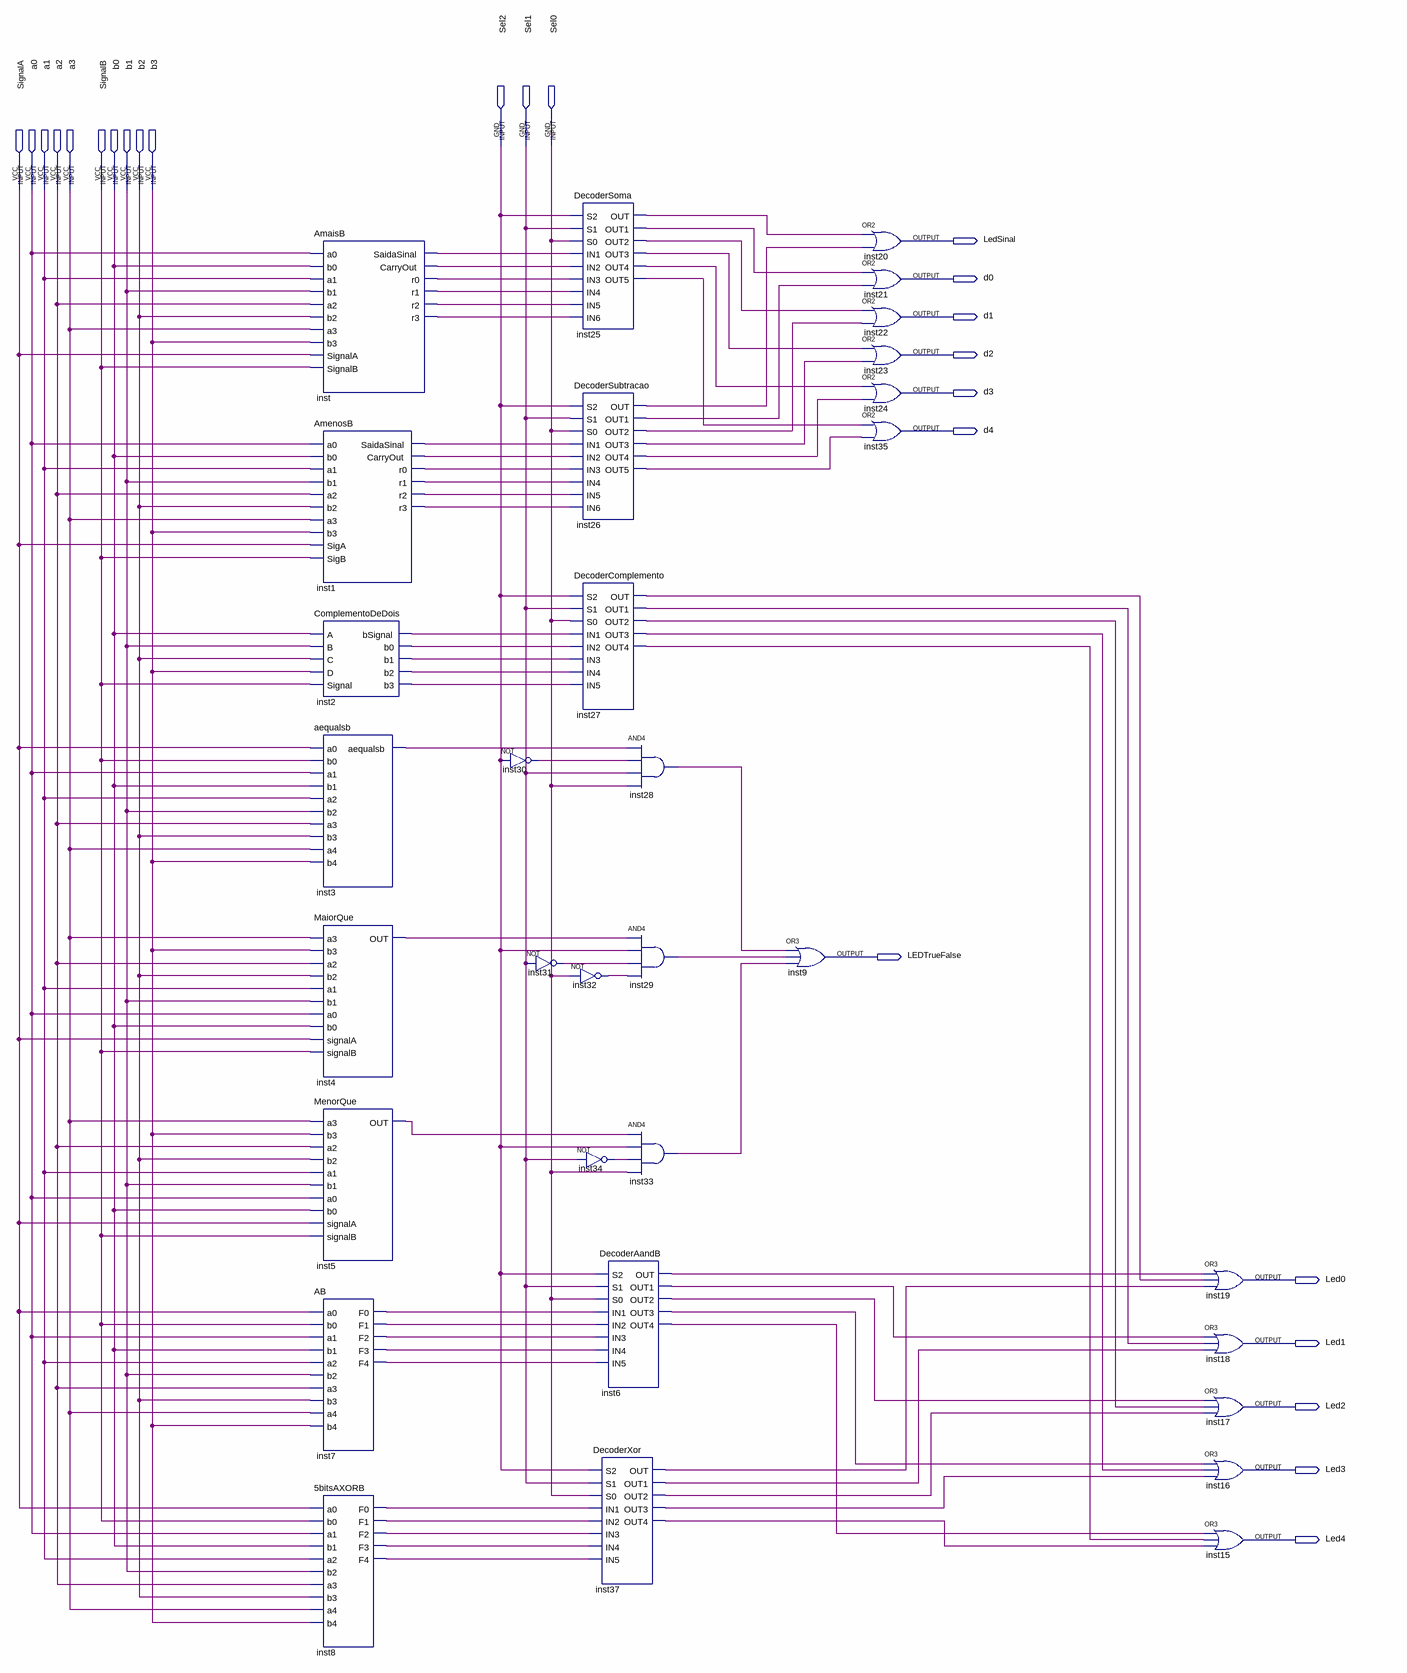
[diagram p0: schematic sheet]
// Quartus schematic ULA.bdf as structural Verilog: 32 symbols, 25 pins
module ULA (
  input  Sel2,
  input  Sel1,
  input  Sel0,
  input  SignalA,
  input  a0,
  input  a1,
  input  a2,
  input  a3,
  input  SignalB,
  input  b0,
  input  b1,
  input  b2,
  input  b3,
  output LedSinal,
  output d0,
  output d1,
  output d2,
  output d3,
  output d4,
  output LEDTrueFalse,
  output Led0,
  output Led1,
  output Led2,
  output Led3,
  output Led4
);

  wire inst1_carryout, inst1_r0, inst1_r1, inst1_r2, inst1_r3, inst1_saidasinal, inst2_b0, inst2_b1,
       inst2_b2, inst2_b3, inst2_bsignal, inst3_aequalsb, inst4_out, inst5_out, inst6_out, inst6_out1,
       inst6_out2, inst6_out3, inst6_out4, inst7_f0, inst7_f1, inst7_f2, inst7_f3, inst7_f4, inst8_f0,
       inst8_f1, inst8_f2, inst8_f3, inst8_f4, inst25_out, inst25_out1, inst25_out2, inst25_out3,
       inst25_out4, inst25_out5, inst26_out, inst26_out1, inst26_out2, inst26_out3, inst26_out4, inst26_out5,
       inst27_out, inst27_out1, inst27_out2, inst27_out3, inst27_out4, inst28_out, inst29_out, inst30_out,
       inst31_out, inst32_out, inst33_out, inst34_out, inst37_out, inst37_out1, inst37_out2, inst37_out3,
       inst37_out4, inst_carryout, inst_r0, inst_r1, inst_r2, inst_r3, inst_saidasinal;

  AmaisB inst (
    .a0(a0), .b0(b0), .a1(a1), .b1(b1), .a2(a2), .b2(b2), .a3(a3), .b3(b3), .SignalA(SignalA),
    .SignalB(SignalB), .SaidaSinal(inst_saidasinal), .CarryOut(inst_carryout), .r0(inst_r0), .r1(inst_r1),
    .r2(inst_r2), .r3(inst_r3));
  AmenosB inst1 (
    .a0(a0), .b0(b0), .a1(a1), .b1(b1), .a2(a2), .b2(b2), .a3(a3), .b3(b3), .SigA(SignalA), .SigB(SignalB),
    .SaidaSinal(inst1_saidasinal), .CarryOut(inst1_carryout), .r0(inst1_r0), .r1(inst1_r1), .r2(inst1_r2),
    .r3(inst1_r3));
  ComplementoDeDois inst2 (
    .A(b0), .B(b1), .C(b2), .D(b3), .Signal(SignalB), .bSignal(inst2_bsignal), .b0(inst2_b0), .b1(inst2_b1),
    .b2(inst2_b2), .b3(inst2_b3));
  aequalsb inst3 (
    .a0(SignalA), .b0(SignalB), .a1(a0), .b1(b0), .a2(a1), .b2(b1), .a3(a2), .b3(b2), .a4(a3), .b4(b3),
    .aequalsb(inst3_aequalsb));
  MaiorQue inst4 (
    .a3(a3), .b3(b3), .a2(a2), .b2(b2), .a1(a1), .b1(b1), .a0(a0), .b0(b0), .signalA(SignalA),
    .signalB(SignalB), .OUT(inst4_out));
  MenorQue inst5 (
    .a3(a3), .b3(b3), .a2(a2), .b2(b2), .a1(a1), .b1(b1), .a0(a0), .b0(b0), .signalA(SignalA),
    .signalB(SignalB), .OUT(inst5_out));
  AB inst7 (
    .a0(SignalA), .b0(SignalB), .a1(a0), .b1(b0), .a2(a1), .b2(b1), .a3(a2), .b3(b2), .a4(a3), .b4(b3),
    .F0(inst7_f0), .F1(inst7_f1), .F2(inst7_f2), .F3(inst7_f3), .F4(inst7_f4));
  \5bitsAXORB  inst8 (
    .a0(SignalA), .b0(SignalB), .a1(a0), .b1(b0), .a2(a1), .b2(b1), .a3(a2), .b3(b2), .a4(a3), .b4(b3),
    .F0(inst8_f0), .F1(inst8_f1), .F2(inst8_f2), .F3(inst8_f3), .F4(inst8_f4));
  not inst30 (inst30_out, Sel2);
  not inst31 (inst31_out, Sel1);
  DecoderSoma inst25 (
    .S2(Sel2), .S1(Sel1), .S0(Sel0), .IN1(inst_saidasinal), .IN2(inst_carryout), .IN3(inst_r0),
    .IN4(inst_r1), .IN5(inst_r2), .IN6(inst_r3), .OUT(inst25_out), .OUT1(inst25_out1), .OUT2(inst25_out2),
    .OUT3(inst25_out3), .OUT4(inst25_out4), .OUT5(inst25_out5));
  DecoderSubtracao inst26 (
    .S2(Sel2), .S1(Sel1), .S0(Sel0), .IN1(inst1_saidasinal), .IN2(inst1_carryout), .IN3(inst1_r0),
    .IN4(inst1_r1), .IN5(inst1_r2), .IN6(inst1_r3), .OUT(inst26_out), .OUT1(inst26_out1), .OUT2(inst26_out2),
    .OUT3(inst26_out3), .OUT4(inst26_out4), .OUT5(inst26_out5));
  DecoderComplemento inst27 (
    .S2(Sel2), .S1(Sel1), .S0(Sel0), .IN1(inst2_bsignal), .IN2(inst2_b0), .IN3(inst2_b1), .IN4(inst2_b2),
    .IN5(inst2_b3), .OUT(inst27_out), .OUT1(inst27_out1), .OUT2(inst27_out2), .OUT3(inst27_out3),
    .OUT4(inst27_out4));
  not inst32 (inst32_out, Sel0);
  not inst34 (inst34_out, Sel1);
  DecoderAandB inst6 (
    .S2(Sel2), .S1(Sel1), .S0(Sel0), .IN1(inst7_f0), .IN2(inst7_f1), .IN3(inst7_f2), .IN4(inst7_f3),
    .IN5(inst7_f4), .OUT(inst6_out), .OUT1(inst6_out1), .OUT2(inst6_out2), .OUT3(inst6_out3),
    .OUT4(inst6_out4));
  DecoderXor inst37 (
    .S2(Sel2), .S1(Sel1), .S0(Sel0), .IN1(inst8_f0), .IN2(inst8_f1), .IN3(inst8_f2), .IN4(inst8_f3),
    .IN5(inst8_f4), .OUT(inst37_out), .OUT1(inst37_out1), .OUT2(inst37_out2), .OUT3(inst37_out3),
    .OUT4(inst37_out4));
  and inst28 (inst28_out, inst3_aequalsb, inst30_out, Sel1, Sel0);
  and inst29 (inst29_out, inst4_out, Sel2, inst31_out, inst32_out);
  and inst33 (inst33_out, inst5_out, Sel2, inst34_out, Sel0);
  or inst9 (LEDTrueFalse, inst28_out, inst29_out, inst33_out);
  or inst20 (LedSinal, inst25_out, inst26_out);
  or inst21 (d0, inst25_out1, inst26_out1);
  or inst22 (d1, inst25_out2, inst26_out2);
  or inst23 (d2, inst25_out3, inst26_out3);
  or inst24 (d3, inst25_out4, inst26_out4);
  or inst35 (d4, inst25_out5, inst26_out5);
  or inst19 (Led0, inst6_out, inst27_out, inst37_out);
  or inst18 (Led1, inst6_out1, inst27_out1, inst37_out1);
  or inst17 (Led2, inst6_out2, inst27_out2, inst37_out2);
  or inst16 (Led3, inst6_out3, inst27_out3, inst37_out3);
  or inst15 (Led4, inst6_out4, inst27_out4, inst37_out4);
endmodule
